# Altium schematic sheet SensingSchDoc.SchDoc
size A4; SheetNumber: 4; SheetTotal: 6
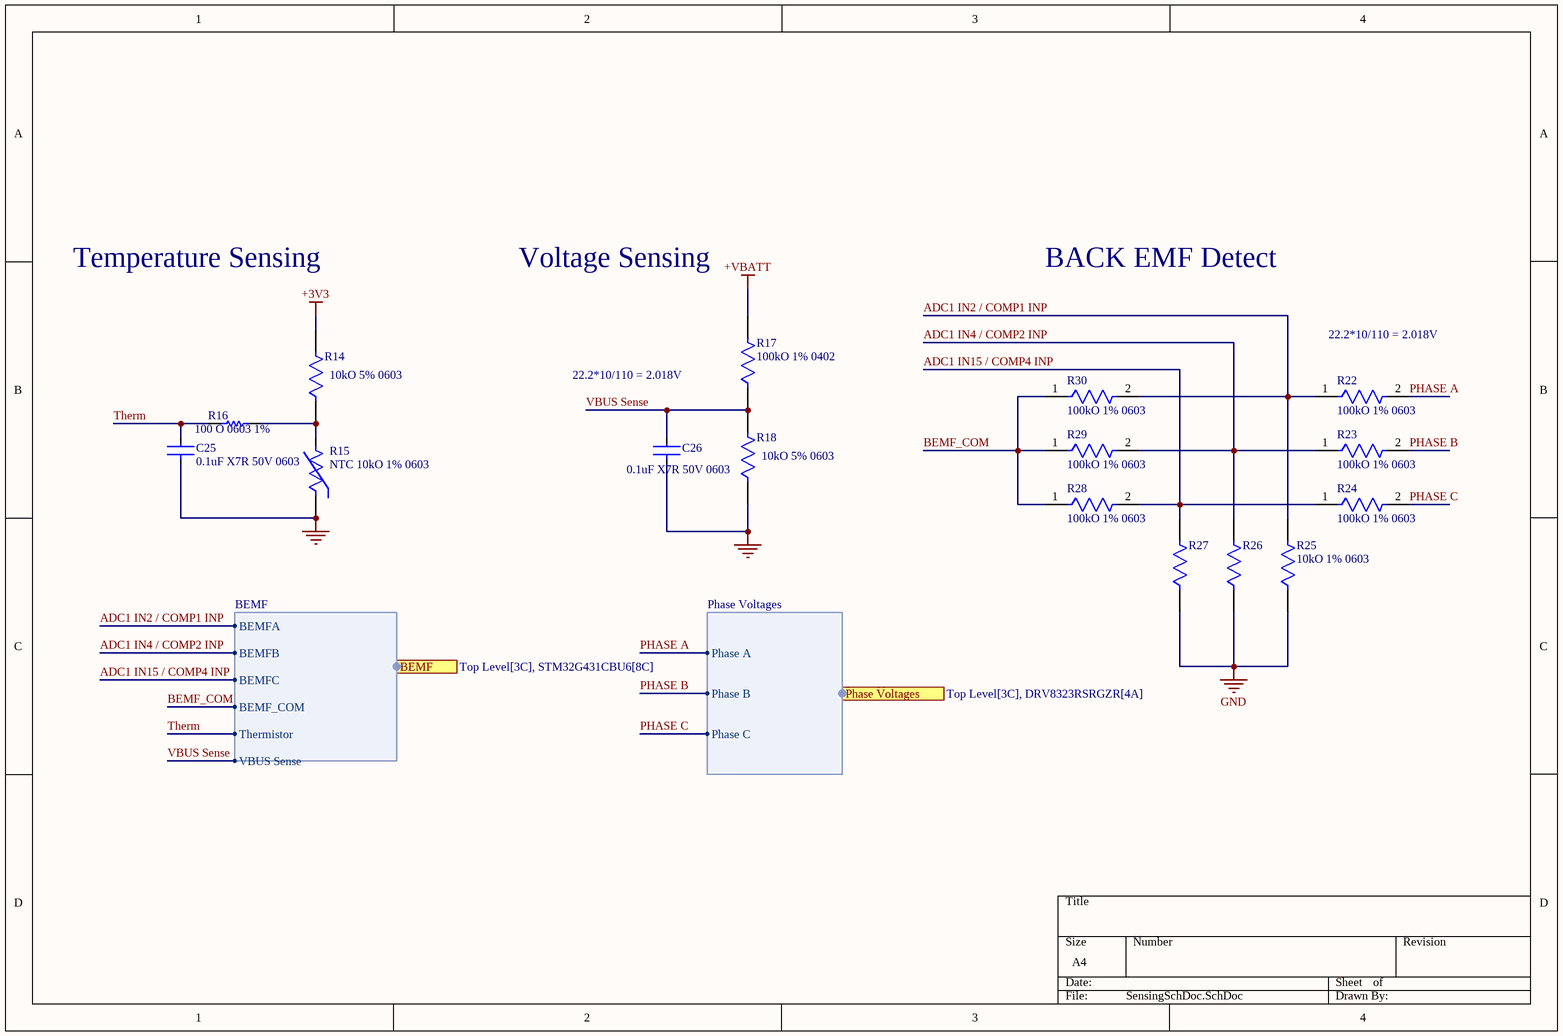
[diagram p0: SensingSchDoc.SchDoc]

## Parts
C25  0.1uF X7R 50V 0603  [FP-0603B104K500CT-IPC_C]
C26  0.1uF X7R 50V 0603  [FP-0603B104K500CT-IPC_C]
R14  10kO 5% 0603  [FP-AC0603-IPC_A]
R15  NTC 10kO 1% 0603  [FP-NCP18-0_15-IPC_A]
R16  100 O 0603 1%  [RESC1608X55X25ML10T15]
R17  100kO 1% 0402  [FP-CRGP0402-IPC_C]
R18  10kO 5% 0603  [FP-AC0603-IPC_A]
R22  100kO 1% 0603  [FP-RT0603-MFG]
R23  100kO 1% 0603  [FP-RT0603-MFG]
R24  100kO 1% 0603  [FP-RT0603-MFG]
R25  10kO 1% 0603  [FP-MCT0603-IPC_C]
R26  10kO 1% 0603  [FP-MCT0603-IPC_C]  (value not drawn)
R27  10kO 1% 0603  [FP-MCT0603-IPC_C]  (value not drawn)
R28  100kO 1% 0603  [FP-RT0603-MFG]
R29  100kO 1% 0603  [FP-RT0603-MFG]
R30  100kO 1% 0603  [FP-RT0603-MFG]

## Ports
BEMF (harness BEMF, see Top Level[3C], STM32G431CBU6[8C]), Phase Voltages (harness Phase Voltages, see Top Level[3C], DRV8323RSRGZR[4A])

## Harnesses
Phase Voltages: Phase A, Phase B, Phase C
BEMF: BEMFA, BEMFB, BEMFC, VBUS Sense, Thermistor, BEMF_COM

## Nets
+3V3: R14.2
+VBATT: R17.2
GND: C25.1 C26.1 R15.1 R18.1 R25.1 R26.1 R27.1
ADC1 IN2 / COMP1 INP: R22.1 R25.2 R30.2 ; port BEMF.BEMFA
ADC1 IN4 / COMP2 INP: R23.1 R26.2 R29.2 ; port BEMF.BEMFB
ADC1 IN15 / COMP4 INP: R24.1 R27.2 R28.2 ; port BEMF.BEMFC
BEMF_COM: R28.1 R29.1 R30.1 ; port BEMF.BEMF_COM
PHASE A: R22.2 ; port Phase Voltages.Phase A
PHASE B: R23.2 ; port Phase Voltages.Phase B
PHASE C: R24.2 ; port Phase Voltages.Phase C
Therm: C25.2 R16.1 ; port BEMF.Thermistor
VBUS Sense: C26.2 R17.1 R18.2 ; port BEMF.VBUS Sense
NetR14_1: R14.1 R15.2 R16.2

## Notes on the sheet
- Temperature Sensing
- Voltage Sensing
- BACK EMF Detect
- 22.2*10/110 = 2.018V

## Library data of the parts
C25 C26 = CMP-45632-000007-1: CAP CER 0.1UF 50V X7R 0603; Tolerance: 10%; Capacitance: 100nF; Radiation Hardening: No; Depth: 0.8mm; Length: 1.6mm; Voltage Rating: 50V; Dielectric: X7R; Case/Package: 0603; RoHS Compliant: Yes; Case Code (Metric): 1608; Voltage Rating (DC): 50V; Min Operating Temperature: -55°C; Series: -; Max Operating Temperature: 125°C; Lead Free: Lead Free; Case Code (Imperial): 0603; Packaging: Tape and Reel
R14 R18 = CMP-03412-040683-1: RES 10kΩ 5.00% 0.2W 0603
R15 = CMP-2000-05271-3: NTC Thermistor for Temperature Sensor, 0603, 10kΩ, 1%, 0.1mA, 5V; Manufacturer Series: NCP18; Accuracy: 0.7%; Current Rating: 310uA; Max Power Dissipation: 100mW; Thermistor Application: TEMPERATURE COMPENSATION; Number of Terminals/Pins: 2; Resistance: 10kR; Case Code (Metric): 1608; RoHS Compliant: Yes; Max Operating Temperature: 125°C; Resistance Tolerance: 1%; Case/Package: 0603; Mount: Surface Mount; Lead Free: Lead Free; Min Operating Temperature: -40°C; REACH SVHC: No SVHC; Package Shape: Rectangular; Radiation Hardening: No; Series: NCP; Depth: 0.8mm; Number of Pins: 2; Length: 1.6mm; Height: 0.8mm; Terminal Placement: Dual; Tolerance: 1%; Case Code (Imperial): 0603; Terminal Finish: Tin; Power Rating: 100mW; Termination: SMD/SMT; Packaging: Tape and Reel; Package Quantity: 1
R16 = CMP-2000-04173-1: Part Number: RC0603FR-10100RL; Manufacturer: Yageo
R17 = CMP-03211-001392-1: SMD Precision Pulse Thick Film Chip Resistor; Manufacturer Part Number: CRGP0402F100K; Manufacturer: TE; Value: 100KΩ; Power Rating: 0.125W; Tolerance: 0.01; Temperature Coefficient: ±100ppm/°C; Voltage Rating: 50V; Octopart: https://octopart.com/crgp0402f100k-te+connectivity-91018658; Ipc Land Pattern Name: RESC11050X35; Digikey Description: SMD Precision Pulse Thick Film Chip Resistor; Composition: Thick Film; Device Class L3: Chip SMD Resistors; Package: CRGP0402; Temperature: -55°C to +155°C; Category: Res; Device Class L1: Passive Components; Temperature Range High: +155°C; ComponentLink2URL: https://www.mouser.ca/datasheet/2/418/NG_DS_9-1773463-9_A-1358566.pdf; Temperature Range Low: -55°C; Series: CRGP; Resistance: 100KΩ; Automotive: No; Lead Free: Yes; RoHS: TRUE; Device Class L2: Resistors; Height: 0.4mm; ComponentLink2Description: Datasheet
R22-R24 R28-R30 = CMP-03412-013434-1: RT0603 100KΩ 0.1W 50 ppm/°C 1.00%; Manufacturer Part Number: RT0603FRE13100KL; Manufacturer: Yageo; Tolerance: 0.01; Voltage Rating: 75V; Temperature: -55°C to +155°C; Automotive: No; Power Rating: 0.1W; Mouser Description: Thin Film Resistors - SMD 1/10W 100K ohm 1% 50ppm; Device Class L1: Passive Components; Device Class L3: Chip SMD Resistors; Series: RT; ComponentLink2URL: http://www.yageo.com/documents/recent/PYu-RT_1-to-0.01_RoHS_L_9.pdf; Package: RT0603; Category: Res; Device Class L2: Resistors; Value: 100KΩ; RoHS: TRUE; Composition: Thin Film; Temperature Range Low: -55°C; Lead Free: Yes; Resistance: 100KΩ; Temperature Range High: +155°C; Ipc Land Pattern Name: RESC16080X45; Octopart: https://octopart.com/rt0603fre13100kl-yageo-16261755; Footprint Url: http://www.yageo.com/exep/pages/download/literatures/PYu-R_Mount_10.pdf; ComponentLink2Description: Datasheet; Temperature Coefficient: 50 ppm/°C; Height: 0.55mm
R25-R27 = CMP-02407-001600-1: RES SMD 100 OHM 1% 1/8W 0603; Max Power Dissipation: 100mW; Resistance: 10kR; Temperature Coefficient: 50ppm/°C; Length: 0.061inch; Depth: 0.85mm; Military Standard: Not; Max Operating Temperature: 125°C; Height: 0.022inch; Case/Package: 0603; Packaging: Tape and Reel; Number of Terminations: 2; Composition: Thin Film; Min Operating Temperature: -55°C; Width: 0.033inch; Tolerance: 1%; Lead Free: Lead Free